# Altium schematic sheet OVP_MCU_PINS.SchDoc
size A
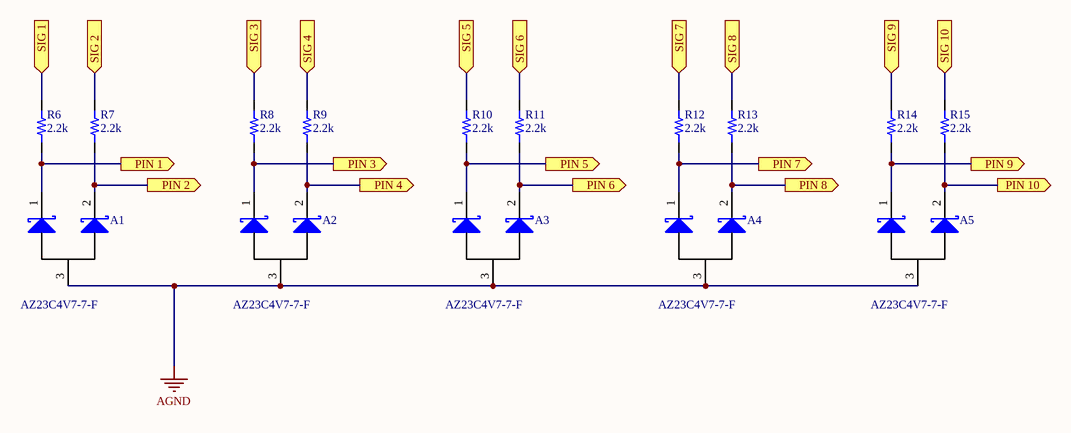
[diagram p0: OVP_MCU_PINS.SchDoc]

## Parts
A1  AZ23C4V7-7-F  [SOT23-3]
A2  AZ23C4V7-7-F  [SOT23-3]
A3  AZ23C4V7-7-F  [SOT23-3]
A4  AZ23C4V7-7-F  [SOT23-3]
A5  AZ23C4V7-7-F  [SOT23-3]
R6  value 2.2k  [RES 0805/2012]  (hidden comment: Resistor 2.2k 0805 1/4W 5%)
R7  value 2.2k  [RES 0805/2012]  (hidden comment: Resistor 2.2k 0805 1/4W 5%)
R8  value 2.2k  [RES 0805/2012]  (hidden comment: Resistor 2.2k 0805 1/4W 5%)
R9  value 2.2k  [RES 0805/2012]  (hidden comment: Resistor 2.2k 0805 1/4W 5%)
R10  value 2.2k  [RES 0805/2012]  (hidden comment: Resistor 2.2k 0805 1/4W 5%)
R11  value 2.2k  [RES 0805/2012]  (hidden comment: Resistor 2.2k 0805 1/4W 5%)
R12  value 2.2k  [RES 0805/2012]  (hidden comment: Resistor 2.2k 0805 1/4W 5%)
R13  value 2.2k  [RES 0805/2012]  (hidden comment: Resistor 2.2k 0805 1/4W 5%)
R14  value 2.2k  [RES 0805/2012]  (hidden comment: Resistor 2.2k 0805 1/4W 5%)
R15  value 2.2k  [RES 0805/2012]  (hidden comment: Resistor 2.2k 0805 1/4W 5%)

## Ports
PIN 1 (out), PIN 2 (out), PIN 3 (out), PIN 4 (out), PIN 5 (out), PIN 6 (out), PIN 7 (out), PIN 8 (out), PIN 9 (out), PIN 10 (out), SIG 1 (in), SIG 2 (in), SIG 3 (in), SIG 4 (in), SIG 5 (in), SIG 6 (in), SIG 7 (in), SIG 8 (in), SIG 9 (in), SIG 10 (in)

## Nets
AGND: A1.3 A2.3 A3.3 A4.3 A5.3
PIN 1: A1.1 R6.1 ; port PIN 1
PIN 2: A1.2 R7.1 ; port PIN 2
PIN 3: A2.1 R8.1 ; port PIN 3
PIN 4: A2.2 R9.1 ; port PIN 4
PIN 5: A3.1 R10.1 ; port PIN 5
PIN 6: A3.2 R11.1 ; port PIN 6
PIN 7: A4.1 R12.1 ; port PIN 7
PIN 8: A4.2 R13.1 ; port PIN 8
PIN 9: A5.1 R14.1 ; port PIN 9
PIN 10: A5.2 R15.1 ; port PIN 10
SIG 1: R6.2 ; port SIG 1
SIG 2: R7.2 ; port SIG 2
SIG 3: R8.2 ; port SIG 3
SIG 4: R9.2 ; port SIG 4
SIG 5: R10.2 ; port SIG 5
SIG 6: R11.2 ; port SIG 6
SIG 7: R12.2 ; port SIG 7
SIG 8: R13.2 ; port SIG 8
SIG 9: R14.2 ; port SIG 9
SIG 10: R15.2 ; port SIG 10

## Library data of the parts
A1-A5 = 14: DIODE ZENER ARRAY 4.7V SOT23-3; Manufacturer_id: 1; idDiode: 14; Num_Circuits: 2; Power: 300mW; Created_By: Angel Delgado; Drawer_id: 1; Name: AZ23C4V7-7-F; Value: 4.7V; Type: Zener Array; Package: SOT23-3; MfrPartNo: AZ23C4V7-7-F; Link: https://www.digikey.com/product-detail/en/diodes-incorporated/AZ23C4V7-7-F/AZ23C4V7-FDICT-ND/815309; Supplier1: Digi-Key
R6-R15 = 1809: Manufacturer_id: 1; idResistor: 1809; Name: Res_2.2k_0805_1/4W_5%; Created_By: Nick Mah; Supplier 1: Digi-Key; Drawer_id: 1; Tolerance: 5%; Power: 1/4W; Package: 0805; ComponentLink1Description: Datasheet; Created_Date: 2018-10-20